# EAGLE design untitled (EAGLE 5.06)
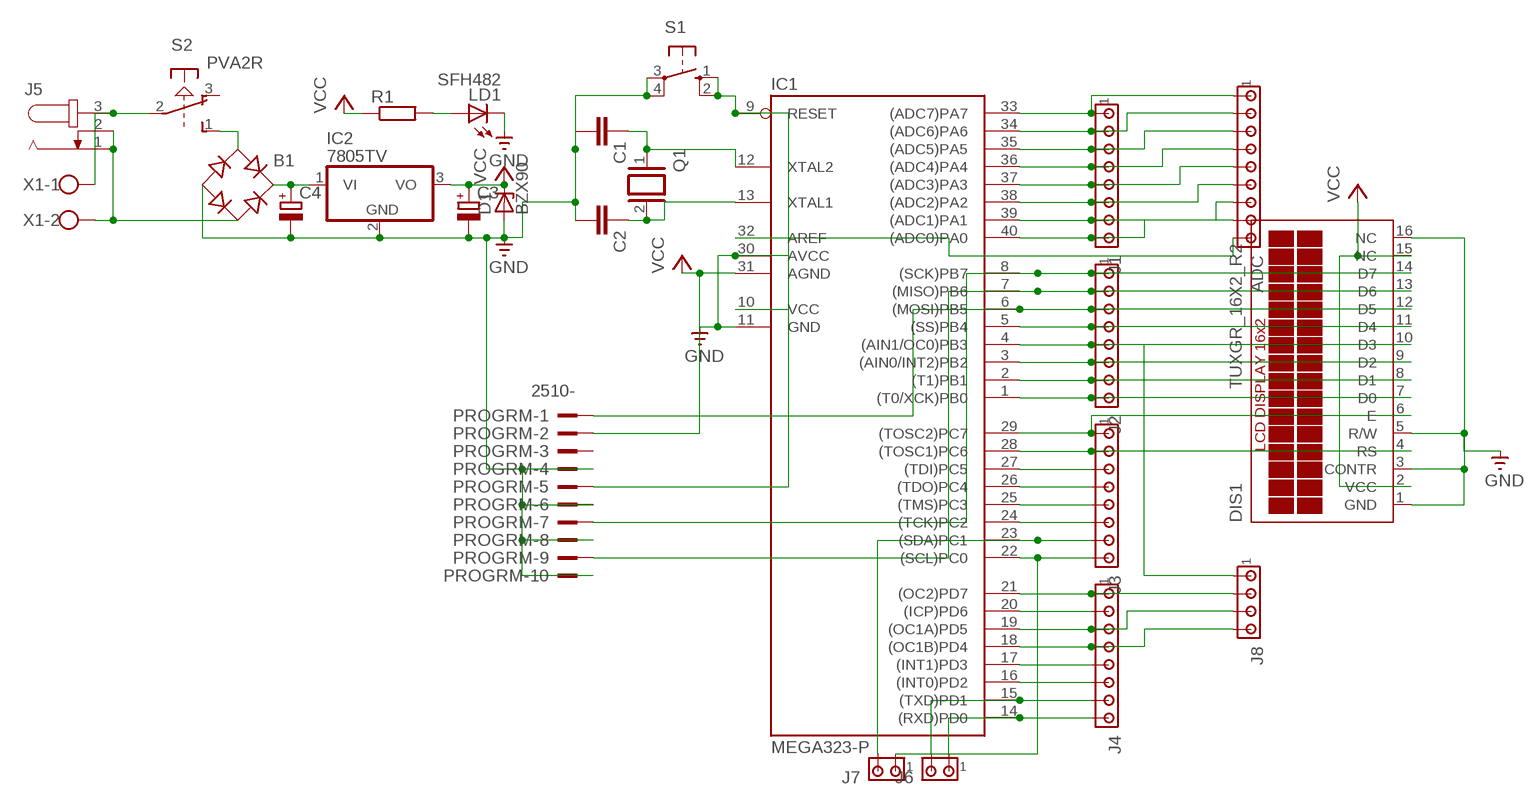
[diagram p0: schematic, sheet 1]

## Parts
ADC  MTA09-100  [10X09MTA]
B1  RB1A  [RB1A]
C1  C2.5/2  [C2.5-2]
C2  C2.5/2  [C2.5-2]
C3  CPOL-EUE5-10.5  [E5-10,5]
C4  CPOL-EUE5-10.5  [E5-10,5]
D1  BZX90  [DO34Z7]
DIS1  TUXGR_16X2_R2  [TUXGR_16X2_R2]
IC1  MEGA323-P  [DIL40]
IC2  7805TV  [TO220V]
J1  MTA08-100  [10X08MTA]
J2  MTA08-100  [10X08MTA]
J3  MTA08-100  [10X08MTA]
J4  MTA08-100  [10X08MTA]
J5  JACK-PLUG1  [SPC4078]
J6  MTA02-100  [10X02MTA]
J7  MTA02-100  [10X02MTA]
J8  MTA04-100  [10X04MTA]
LD1  SFH482  [SFH482]
PROGRM  2510-  [PAK100/2500-10]
Q1  XTAL/S  [QS]
R1  R-EU_0207/10  [0207/10]
S1  10-XX  [B3F-10XX]
S2  PVA2R  [PVA2R]
X1  AK300/2  [AK300/2]

## Nets
GND: B1.- C1.2 C2.2 C3.- C4.- D1.A DIS1.1(GND) DIS1.3(CONTR) DIS1.5(R/W) DIS1.16(NC) IC1.11(GND) IC1.31(AGND) IC2.2(GND) LD1.K(C) PROGRM.4 PROGRM.6 PROGRM.8 PROGRM.10 S1.3(P) S1.4(P1)
N$1: B1.AC2 J5.1 J5.2 X1.2
N$2: J5.3 S2.2(1:P) X1.1
N$3: B1.AC1 S2.1(1:S)
N$4: B1.+ C4.+ IC2.1(VI)
N$5: ADC.9 IC1.32(AREF)
N$6: DIS1.14(D7) IC1.8((SCK)PB7) J2.1 PROGRM.7
N$7: C1.1 IC1.12(XTAL2) Q1.1
N$8: C2.1 IC1.13(XTAL1) Q1.2
N$9: DIS1.13(D6) IC1.7((MISO)PB6) J2.2 PROGRM.9
N$10: ADC.1 IC1.33((ADC7)PA7) J1.1
N$11: ADC.2 IC1.34((ADC6)PA6) J1.2
N$12: ADC.3 IC1.35((ADC5)PA5) J1.3
N$13: ADC.4 IC1.36((ADC4)PA4) J1.4
N$14: ADC.5 IC1.37((ADC3)PA3) J1.5
N$15: ADC.6 IC1.38((ADC2)PA2) J1.6
N$16: ADC.7 IC1.39((ADC1)PA1) J1.7
N$17: ADC.8 IC1.40((ADC0)PA0) J1.8
N$19: DIS1.11(D4) IC1.5((SS)PB4) J2.4
N$20: DIS1.10(D3) IC1.4((AIN1/OC0)PB3) J2.5 J8.1
N$21: DIS1.9(D2) IC1.3((AIN0/INT2)PB2) J2.6
N$22: DIS1.8(D1) IC1.2((T1)PB1) J2.7
N$23: DIS1.7(D0) IC1.1((T0/XCK)PB0) J2.8
N$24: DIS1.6(E) IC1.29((TOSC2)PC7) J3.1
N$25: DIS1.4(RS) IC1.28((TOSC1)PC6) J3.2
N$26: IC1.27((TDI)PC5) J3.3
N$27: IC1.26((TDO)PC4) J3.4
N$28: IC1.25((TMS)PC3) J3.5
N$29: IC1.24((TCK)PC2) J3.6
N$30: IC1.23((SDA)PC1) J3.7 J7.2
N$31: IC1.22((SCL)PC0) J3.8 J7.1
N$32: IC1.21((OC2)PD7) J4.1 J8.2
N$33: IC1.20((ICP)PD6) J4.2
N$34: IC1.19((OC1A)PD5) J4.3 J8.3
N$35: IC1.18((OC1B)PD4) J4.4 J8.4
N$36: IC1.17((INT1)PD3) J4.5
N$37: IC1.16((INT0)PD2) J4.6
N$38: IC1.15((TXD)PD1) J4.7 J6.2
N$39: IC1.14((RXD)PD0) J4.8 J6.1
N$41: IC1.9(RESET) PROGRM.5 S1.1(S) S1.2(S1)
N$42: DIS1.12(D5) IC1.6((MOSI)PB5) J2.3 PROGRM.1
N$46: LD1.A R1.2
VCC: C3.+ D1.C DIS1.2(VCC) DIS1.15(NC) IC1.10(VCC) IC1.30(AVCC) IC2.3(VO) PROGRM.2 R1.1
Unconnected: PROGRM.3 S2.3(1:O) S2.4(2:S) S2.5(2:P) S2.6(2:O)

## Library data of the parts
ADC = con-amp:MTA09-100: AMP connector
B1 = rectifier:RB1A: RECTIFIER 1 A
C1 C2 = capacitor-wima:C: CAPACITOR naming: grid - package width
C3 C4 = rcl:CPOL-EU: POLARIZED CAPACITOR, European symbol
D1 = diode:BZX90: Z DIODE
DIS1 = display-lcd:TUXGR_16X2_R2: Tuxgraphics LCD display 16x2 characters reflective, without background light Source: tuxgr_12x2_r2.pdf
IC1 = atmel:MEGA323-P: MICROCONTROLLER 32 Kbytes FLASH 2 Kbytes SRAM 1 Kbytes EEPROM USART 8-channel 10 bit ADC Source: avr.lbr
IC2 = linear:78*: Positive VOLTAGE REGULATOR Source: http://cache.national.com/ds/LM/LM78L05.pdf http://www.fairchildsemi.com/ds/LM/LM7805.pdf
J1-J4 = con-amp:MTA08-100: AMP connector
J5 = con-jack:JACK-PLUG: DC POWER JACK Power Jack, DC, Right Angle, Through Hole, Rated 5A at 16VDC, PC Terminals Distributor: Farnell (www.Farnell.de) Drawing: 84N1161.pdf / 84N1162.pdf Manufacturer: SPC Technology (www.spctechnology.com) Type: SPC4077 / SPC 4078
J6 J7 = con-amp:MTA02-100: AMP connector
J8 = con-amp:MTA04-100: AMP connector
LD1 = led:SFH482: IR LED infrared emitting diode, Infineon
PROGRM = con-3m:2510-: 3M (TM) Pak 100 4-Wall Header Source: 3M
Q1 = special:XTAL/S: CRYSTAL
R1 = rcl-2:R-EU_: RESISTOR, European symbol
S1 = switch-omron:10-XX: OMRON SWITCH
S2 = switch-misc:PVA2R: ITT SWITCH
X1 = con-ptr500+:AK300/2: CONNECTOR

## Board
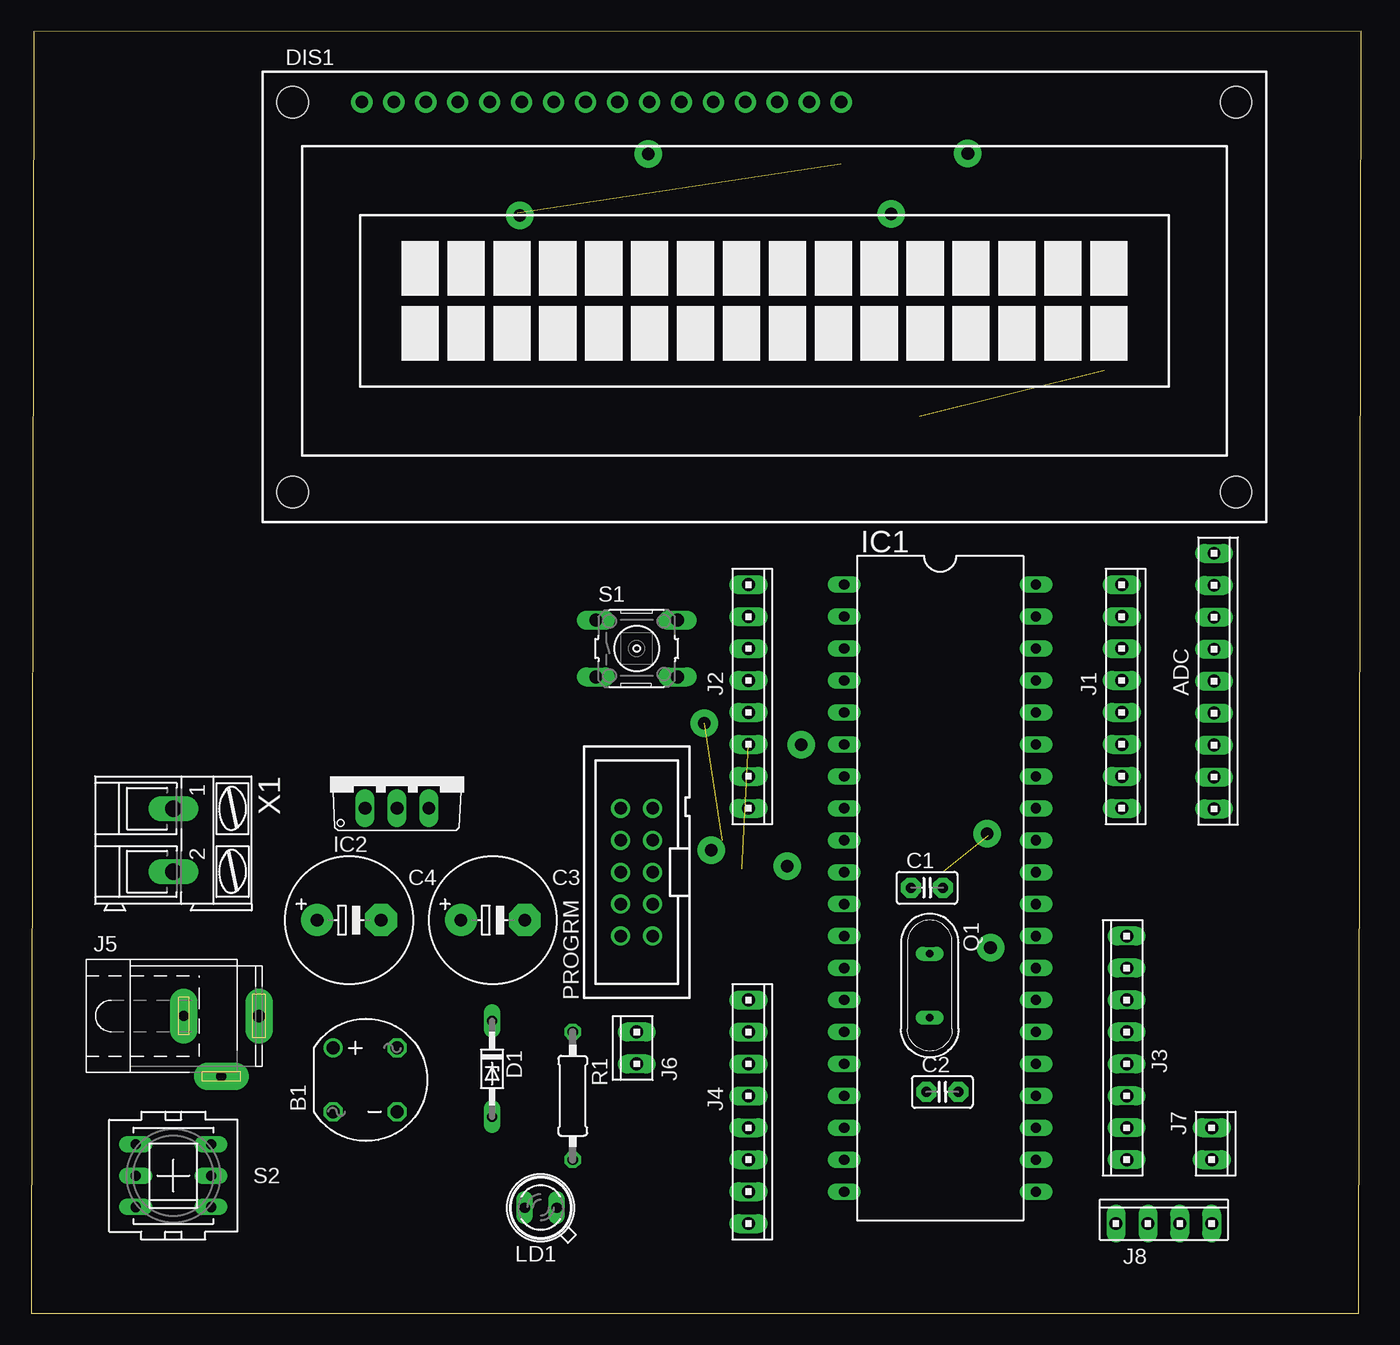
[diagram p1: board, top side]
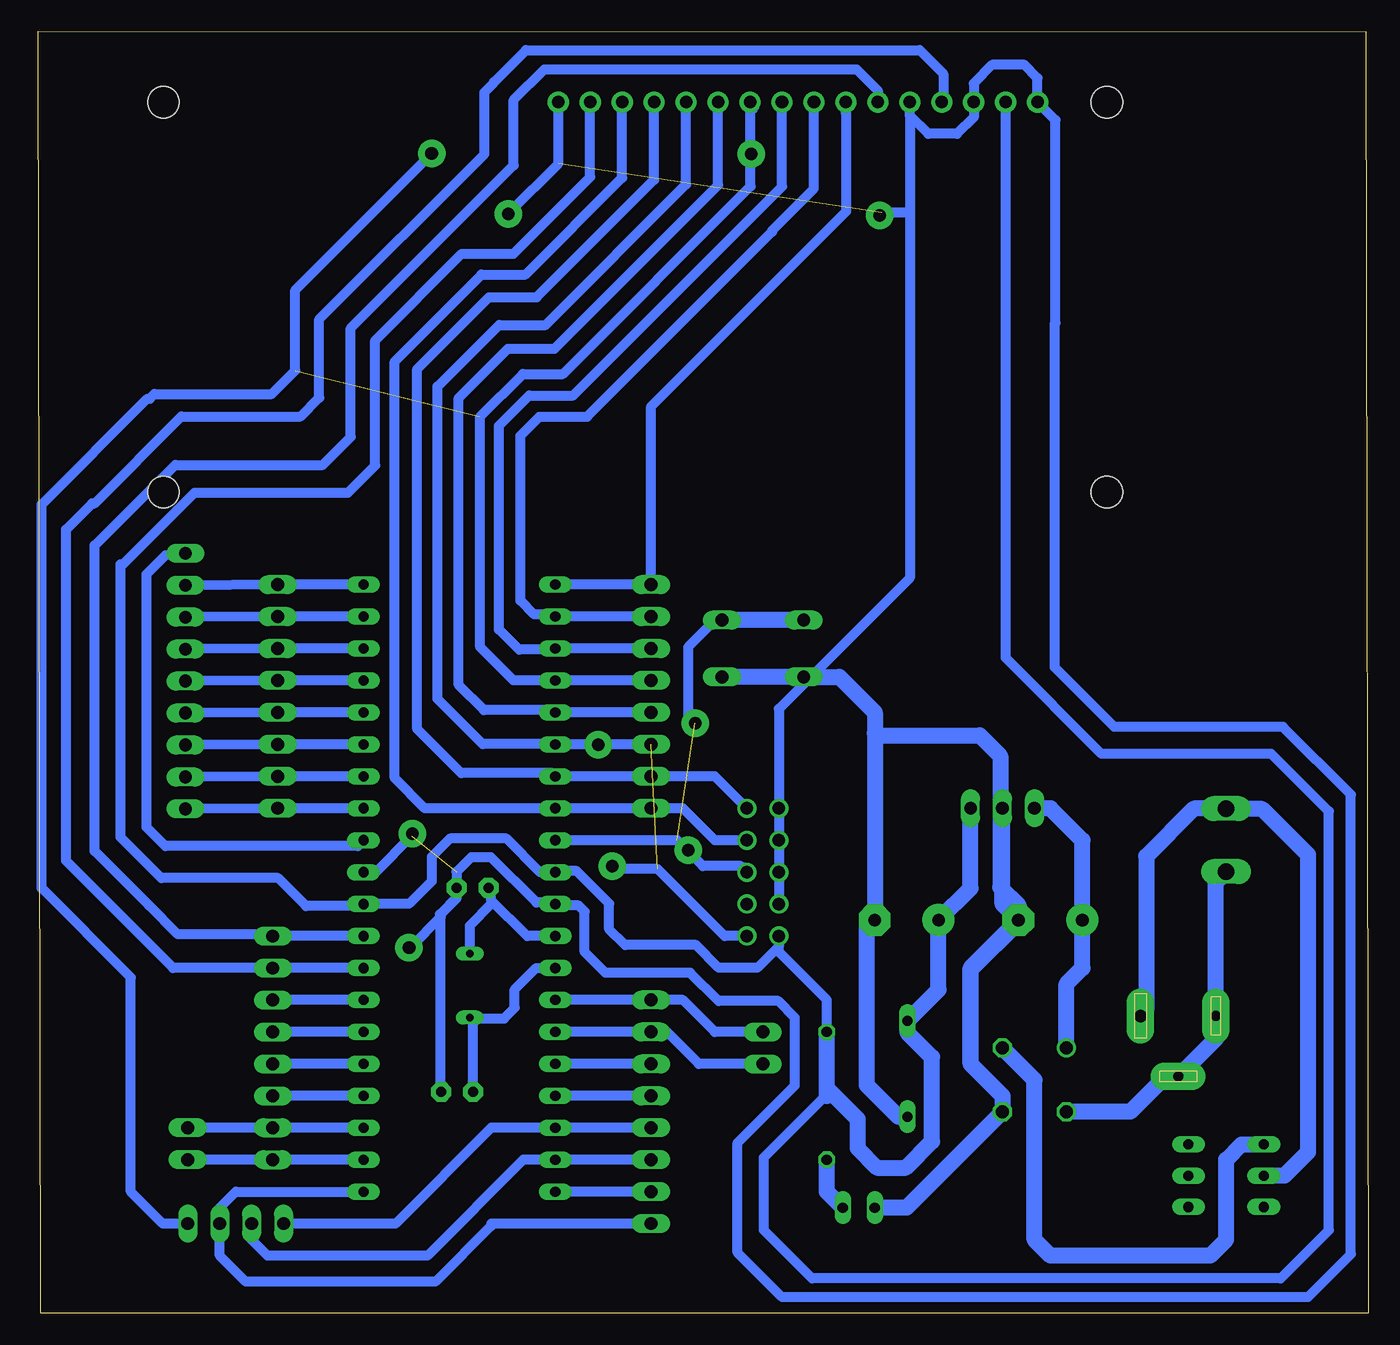
[diagram p2: board, bottom side, seen from below]

Size 105.71 x 101.89 mm. Coordinates in mm from the lower left corner, seen from the top.
Outline: 0,0 105.52,0.01 105.71,101.89 0.19,101.89 0,0
Copper layers (1*16): Top 0.8mm / dielectric 1.5mm / Bottom 0.8mm
Design rules: minimum track width 10mil, minimum drill 24mil, track to track 8mil, track to pad 8mil, pad to pad 8mil, via to via 8mil, smd to smd 8mil, copper to edge 40mil, drill to drill 8mil, minimum pad ring 10mil, minimum via ring 8mil, stop-mask expansion 4mil, vias tented up to drill 0mil, thermal gap 10mil

### Footprints (pad centres in the part's own frame; a part is rotated, then mirrored left to right if it is on the bottom)
10X09MTA = drill 1.016 long: 1 10.16,0; 2 7.62,0; 3 5.08,0; 4 2.54,0; 5 0,0; 6 -2.54,0; 7 -5.08,0; 8 -7.62,0; 9 -10.16,0
RB1A = drill 1.016: + -2.54,2.54 | drill 1.016 octagon: - 2.54,-2.54; AC1 2.54,2.54; AC2 -2.54,-2.54
C2.5-2 = drill 0.813 pad 1.6 octagon: 1 -1.27,0; 2 1.27,0
E5-10,5 = drill 1.016 pad 2.54: + -2.54,0 | drill 1.016 pad 2.54 octagon: - 2.54,0
DO34Z7 = drill 0.813 long: A 3.81,0; C -3.81,0
TUXGR_16X2_R2 = drill 1 pad 1.676: 1 -32,15.5; 2 -29.46,15.5; 3 -26.92,15.5; 4 -24.38,15.5; 5 -21.84,15.5; 6 -19.3,15.5; 7 -16.76,15.5; 8 -14.22,15.5; 9 -11.68,15.5; 10 -9.14,15.5; 11 -6.6,15.5; 12 -4.06,15.5; 13 -1.52,15.5; 14 1.02,15.5; 15 3.56,15.5; 16 6.1,15.5 | hole 2.5: -37.5,-15.5; 37.5,-15.5; -37.5,15.5; 37.5,15.5
DIL40 = drill 0.813 long: 1 -24.13,-7.62; 2 -21.59,-7.62; 3 -19.05,-7.62; 4 -16.51,-7.62; 5 -13.97,-7.62; 6 -11.43,-7.62; 7 -8.89,-7.62; 8 -6.35,-7.62; 9 -3.81,-7.62; 10 -1.27,-7.62; 11 1.27,-7.62; 12 3.81,-7.62; 13 6.35,-7.62; 14 8.89,-7.62; 15 11.43,-7.62; 16 13.97,-7.62; 17 16.51,-7.62; 18 19.05,-7.62; 19 21.59,-7.62; 20 24.13,-7.62; 21 24.13,7.62; 22 21.59,7.62; 23 19.05,7.62; 24 16.51,7.62; 25 13.97,7.62; 26 11.43,7.62; 27 8.89,7.62; 28 6.35,7.62; 29 3.81,7.62; 30 1.27,7.62; 31 -1.27,7.62; 32 -3.81,7.62; 33 -6.35,7.62; 34 -8.89,7.62; 35 -11.43,7.62; 36 -13.97,7.62; 37 -16.51,7.62; 38 -19.05,7.62; 39 -21.59,7.62; 40 -24.13,7.62
TO220V = drill 1.016 long: 1 -2.54,-2.54; 2 0,-2.54; 3 2.54,-2.54
10X08MTA = drill 1.016 long: 1 8.89,0; 2 6.35,0; 3 3.81,0; 4 1.27,0; 5 -1.27,0; 6 -3.81,0; 7 -6.35,0; 8 -8.89,0
SPC4078 = drill 0.8 pad 2.184 long: 1 -3,0; 2 0,-4.8 | drill 1 pad 2.184 long: 3 3,0
10X02MTA = drill 1.016 long: 1 1.27,0; 2 -1.27,0
10X04MTA = drill 1.016 long: 1 3.81,0; 2 1.27,0; 3 -1.27,0; 4 -3.81,0
SFH482 = drill 0.813 long: A -1.27,0; K 1.27,0
PAK100/2500-10 = drill 1 pad 1.422: 1 -5.08,-1.27; 2 -5.08,1.27; 3 -2.54,-1.27; 4 -2.54,1.27; 5 0,-1.27; 6 0,1.27; 7 2.54,-1.27; 8 2.54,1.27; 9 5.08,-1.27; 10 5.08,1.27
QS = drill 0.61 long: 1 -2.54,0; 2 2.54,0
0207/10 = drill 0.813 octagon: 1 -5.08,0; 2 5.08,0
B3F-10XX = drill 1.016 long: 1 -3.251,2.261; 2 3.251,2.261; 3 -3.251,-2.261; 4 3.251,-2.261
PVA2R = drill 0.813 long: 1 -2.997,2.489; 2 -2.997,0; 3 -2.997,-2.489; 4 2.997,2.489; 5 2.997,0; 6 2.997,-2.489
AK300/2 = drill 1.321 long: 1 -2.515,0; 2 2.489,0

### Placement (x,y rotation side)
ADC  94.02,50.24 270 top
B1  26.52,18.54 0 top
C1  71.19,33.81 0 top
C2  72.41,17.59 0 top
C3  36.68,31.24 0 top
C4  25.25,31.24 0 top
D1  36.62,19.42 270 top
DIS1  58.27,80.77 0 top
IC1  72.24,33.78 270 top
IC2  29.06,42.67 0 top
J1  86.68,49.02 270 top
J2  57,49.02 270 top
J3  87.07,21.08 90 top
J4  57,16 270 top
J5  15.09,23.62 0 top
J6  48.11,21.08 90 top
J7  93.83,13.46 270 top
J8  90.02,7.11 0 top
LD1  40.49,8.38 180 top
PROGRM  48.11,35.05 90 top
Q1  71.41,26.04 270 top
R1  43.03,17.27 270 top
S1  48.11,52.83 0 top
S2  11.28,10.92 0 top
X1  11.28,37.59 270 top

### Tracks (layer width: path | path; a pad name or v marks a point on that pad's centre or on a via)
GND  (2 unrouted)
  Bottom 0.813: PROGRM.4 PROGRM.6 PROGRM.8 PROGRM.10 46.84,48.03 45.06,49.81 | 45.06,49.81 44.3,50.57 | 36.43,95.21 36.43,87.48 | 36.43,87.48 36.43,58.44 45.06,49.81 | 36.43,95.21 DIS1.5 | 72.46,33.04 C1.2 | 72.46,33.04 73.78,31.72 73.78,17.69 C2.2 | 47.79,15.88 45.57,18.1 45.57,23.49 46.89,24.81 51.63,24.81 53.89,27.07 60.63,27.07 62.28,28.72 62.28,31.93 62.75,32.4 64.51,32.4 IC1.11 64.75,32.65 66.12,32.65 69.72,36.24 71.3,36.24 72.46,35.08 | 47.79,15.88 | 47.79,15.88 50.12,13.55 50.12,4.8 46.59,1.27 4.79,1.27 1.37,4.68 1.37,41.22 6.76,46.61 20.18,46.61 24.91,51.34 24.91,78.65 24.85,78.71 24.85,94.85 DIS1.1 26.27,98.19 27.31,99.23 29.9,99.23 31.35,97.78 DIS1.3 31.35,95.07 32.67,93.75 34.97,93.75 36.43,95.21 | 72.46,35.08 72.46,33.04 | IC1.31 78.88,35.05 76.02,37.92 | 72.46,35.08 72.46,32.96 73.71,31.71 73.71,31.49 76.13,29.08 | DIS1.16 64.37,91.4 68.29,87.48 | 36.43,87.48 38.64,87.48 38.66,87.45
  Bottom 1.27: IC2.2 29.06,32.51 C4.- 31.6,27.43 31.6,19.81 | LD1.K 36.68,8.38 B1.- 29.06,17.27 31.6,19.81 | 39.22,46.12 C3.- 39.87,30.59 39.87,18.14 37.34,15.61 D1.A | 39.22,46.12 39.22,47.75 42.04,50.57 44.3,50.57 S1.3 S1.4 | 31.6,19.81 31.6,27.29 27.77,31.12 27.77,32.4 29.23,33.86 29.23,44.29 30.88,45.94 39.04,45.94 39.22,46.12
N$1
  Bottom 1.27: X1.2 11.28,35.05 12.09,34.24 J5.1 12.09,21.82 J5.2 16.08,18.82 18.9,16 B1.AC2
N$2
  Bottom 1.27: J5.3 17.63,24.08 17.63,36.32 13.85,40.11 X1.1 11.25,40.08 8.42,40.08 4.76,36.43 4.76,12.82 6.66,10.92 S2.2
N$3
  Bottom 1.27: S2.1 10.06,13.41 11.28,12.19 11.28,5.84 12.55,4.57 25.25,4.57 26.52,5.84 26.52,18.54 B1.AC1
N$4
  Bottom 1.27: B1.+ 23.98,26.16 22.71,27.43 C4.+ 22.71,37.59 25.25,40.13 IC2.1
N$5
  Bottom 0.813: ADC.9 95.59,60.26 97.1,58.75 97.1,38.62 95.62,37.14 80.32,37.14 IC1.32
N$6
  Bottom 0.813: PROGRM.7 51.92,37.59 54.46,40.13 J2.1 IC1.8 74.98,40.13 77.38,42.53 77.38,75.66 70.48,82.57 66.98,82.57 59.29,90.26 DIS1.14
N$7
  Bottom 0.813: Q1.1 71.41,30.81 69.7,32.52 69.7,32.83 | 69.7,32.83 69.7,33.59 C1.1 | IC1.12 66.85,29.97 69.7,32.83
N$8
  Bottom 0.813: C2.1 71.14,23.23 Q1.2 71.35,23.43 68.68,23.43 67.84,24.27 67.84,25.73 66.14,27.43 IC1.13
N$9
  Bottom 0.813: PROGRM.9 51.92,42.67 J2.2 IC1.7 64.88,42.94 72.08,42.94 75.58,46.44 75.58,75.06 69.88,80.77 66.08,80.77 56.75,90.1 DIS1.13
N$10
  Bottom 0.813: IC1.33 J1.1 ADC.1
N$11
  Bottom 0.813: IC1.34 J1.2 ADC.2
N$12
  Bottom 0.813: IC1.35 J1.3 ADC.3
N$13
  Bottom 0.813: IC1.36 J1.4 ADC.4
N$14
  Bottom 0.813: IC1.37 J1.5 ADC.5
N$15
  Bottom 0.813: IC1.38 J1.6 ADC.6
N$16
  Bottom 0.813: IC1.39 J1.7 ADC.7
N$17
  Bottom 0.813: IC1.40 J1.8 ADC.8
N$18  (via drill 1 pad 2.18)
  other vias: 76.23,29.05
N$19
  Bottom 0.813: J2.4 IC1.5 64.81,47.94 70.28,47.94 72.28,49.94 72.28,72.76 68.38,76.66 64.68,76.66 51.67,89.68 DIS1.11
N$20  (1 unrouted)
  Bottom 0.813: J2.5 IC1.4 67.93,50.29 70.58,52.94 70.58,71.26 67.18,74.66 64,74.66 49.09,89.57 49.09,95.58 48.79,95.88 48.79,95.93 DIS1.10 | J8.1 95.81,7.11 98.35,9.65 98.35,26.69 105.44,33.79 105.44,64.3 97.04,72.7 96.86,72.7 96.48,73.07 87.15,73.07 85.28,74.94 85.28,81.32 74.64,91.97
N$21
  Bottom 0.813: J2.6 IC1.3 64.71,52.74 67.48,52.74 69.08,54.34 69.08,70.56 66.68,72.96 63.18,72.96 46.59,89.55 DIS1.9
N$22
  Bottom 0.813: J2.7 IC1.2 64.79,55.55 66.28,55.55 67.38,56.65 67.38,69.76 65.88,71.26 62.08,71.26 47.39,85.96 47.39,86.07 44.05,89.41 DIS1.8
N$23
  Bottom 0.813: IC1.1 J2.8 57,72.08 41.48,87.6 41.48,95.38 41.52,95.42 41.52,96.17 41.5,96.18 DIS1.7
N$24
  Bottom 0.813: IC1.29 J3.1 87.23,30.13 94.63,30.13 96.9,32.39 96.9,32.4 101.24,36.74 101.24,61.02 94.83,67.44 83.09,67.44 81.61,68.92 | DIS1.6 38.97,97.2 40.66,98.89 65.48,98.89 67.92,96.46 67.92,91.25 80.87,78.3 80.87,69.66 81.61,68.92 | 81.61,68.92 81.51,69.02
N$25
  Bottom 0.813: J3.2 IC1.28 94.99,27.43 103.51,35.95 103.51,62.31 101.44,64.38 101.24,64.38 94.33,71.29 84.86,71.29 83.38,72.77 83.38,79.02 70.25,92.15 70.25,97.06 69.49,97.83 69.49,97.86 66.95,100.4 35.64,100.4 33.76,98.53 33.76,96.4 DIS1.4
N$26
  Bottom 0.813: IC1.27 J3.3
N$27
  Bottom 0.813: IC1.26 J3.4
N$28
  Bottom 0.813: IC1.25 J3.5
N$29
  Bottom 0.813: IC1.24 J3.6
N$30
  Bottom 0.813: J7.2 J3.7 IC1.23
N$31
  Bottom 0.813: IC1.22 J3.8 J7.1
N$32
  Bottom 0.813: IC1.21 90.02,9.65 91.29,8.38 J8.2 91.29,4.57 89.21,2.49 74.13,2.49 69.7,6.93 69.7,7.11 J4.1
N$33
  Bottom 0.813: J4.2 IC1.20
N$34
  Bottom 0.813: J4.3 IC1.19 67.16,12.19 74.78,4.57 87.48,4.57 88.75,5.84 J8.3
N$35
  Bottom 0.813: J4.4 IC1.18 69.7,14.73 77.32,7.11 J8.4
N$36
  Bottom 0.813: J4.5 IC1.17
N$37
  Bottom 0.813: J4.6 IC1.16
N$38
  Bottom 0.813: IC1.15 J4.7 55.73,22.35 53.19,19.81 J6.2
N$39
  Bottom 0.813: IC1.14 J4.8 54.46,24.89 51.92,22.35 J6.1
N$40  (via drill 1 pad 2.18)
  other vias: 75.98,38.1
N$41  (1 unrouted)
  Bottom 0.813: IC1.9 54.93,37.59 52.87,35.54 49.87,35.54 PROGRM.5 | S1.2 51.91,55.1 54.05,52.95 54.05,47.46 53.5,46.91
  Bottom 1.27: S1.1 S1.2
N$42  (1 unrouted)
  Bottom 0.813: J2.3 IC1.6 64.64,45.24 70.38,45.24 73.98,48.84 73.98,73.66 69.08,78.56 65.38,78.56 54.21,89.74 DIS1.12 | PROGRM.1 51.15,29.97 56.48,35.31 60.01,35.31 60.24,35.54
N$43  (via drill 1 pad 2.18)
  other vias: 49.03,92.14
N$44  (via drill 1 pad 2.18)
  other vias: 54.05,36.8
N$45  (via drill 1 pad 2.18)
  other vias: 53.5,46.91
N$46
  Bottom 1.27: R1.2 43.03,9.65 LD1.A
N$47  (via drill 1 pad 2.18)
  other vias: 61.18,45.19
N$48  (via drill 1 pad 2.18)
  other vias: 60.09,35.54
N$49  (via drill 1 pad 2.18)
  other vias: 74.44,92.21
N$50  (via drill 1 pad 2.18)
  other vias: 68.33,87.4
N$51  (via drill 1 pad 2.18)
  other vias: 38.83,87.28
VCC
  Bottom 0.813: R1.1 43.03,24.89 46.84,28.7 PROGRM.2 46.84,29.17 48.55,27.46 51.62,27.46 53.42,29.27 59.07,29.27 60.32,30.52 60.32,32.56 62.91,35.15 64.53,35.15 IC1.10 | DIS1.2 28.81,52.08 21.2,44.47 7.69,44.47 3.12,39.9 3.12,6.59 6.96,2.76 44.2,2.76 48.04,6.6 48.04,12.38 43.03,17.39 | IC1.10 64.45,35.22 | IC1.10 64.61,35.04 | IC1.10 65.81,35.05 68.49,37.74 72.98,37.74 74.45,36.27 74.45,34.34 76.23,32.55 79.82,32.55 IC1.30 80,32.37 84.43,32.37 86.65,34.59 95.94,34.59 99.17,37.83 99.17,59.34 | DIS1.15 61.83,90.32 67.94,84.21 72.05,84.21 78.93,77.33 78.93,67.39 81.09,65.22 93.29,65.22 99.17,59.34 | 99.17,59.34 99.17,59.54
  Bottom 1.27: IC2.3 31.6,33.78 C3.+ 34.14,25.71 D1.C 36.62,22.3 34.67,20.35 34.67,13.65 36.75,11.57 39.03,11.57 40.59,13.13 40.59,15.44 43.03,17.88 | 43.03,17.27 43.03,17.39 43.03,17.88 | 43.03,17.88 R1.1